# EAGLE schematic 74595 (EAGLE 6.4)
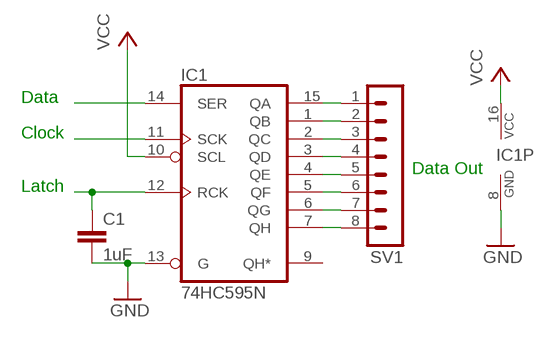
[diagram p0: schematic, sheet 1]

## Parts
C1  1uF  C-EU025-024X044  [C025-024X044]
IC1  74HC595N  [DIL16]
SV1  MA08-1  [MA08-1]

## Nets
GND: C1.2 IC1.8(GND) IC1.13(G)
N$1: IC1.14(SER)
N$2: IC1.11(SCK)
N$3: C1.1 IC1.12(RCK)
N$4: IC1.15(QA) SV1.1
N$5: IC1.1(QB) SV1.2
N$6: IC1.2(QC) SV1.3
N$7: IC1.3(QD) SV1.4
N$8: IC1.4(QE) SV1.5
N$9: IC1.5(QF) SV1.6
N$10: IC1.6(QG) SV1.7
N$11: IC1.7(QH) SV1.8
VCC: IC1.10(SCL) IC1.16(VCC)
Unconnected: IC1.9(QH*)

## Notes on the sheet
- Data
- Clock
- Data Out
- Latch

## Library data of the parts
C1 = rcl:C-EU: CAPACITOR, European symbol
IC1 = 74xx-eu:74*595: 8-bit SHIFT REGISTER, output latch
SV1 = con-lstb:MA08-1: PIN HEADER; OC_FARNELL: unknown; OC_NEWARK: unknown